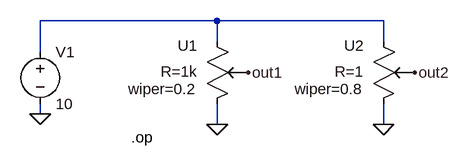
[diagram p0: schematic pot_test.asc]
pot_test.asc, the LTspice schematic file:
Version 4
SHEET 1 880 680
WIRE 272 48 0 48
WIRE 528 48 272 48
WIRE 272 80 272 48
WIRE 528 80 528 48
WIRE 0 96 0 48
WIRE 0 192 0 176
WIRE 272 208 272 176
WIRE 528 208 528 176
FLAG 272 208 0
FLAG 0 192 0
FLAG 320 128 out1
FLAG 528 208 0
FLAG 576 128 out2
SYMBOL voltage 0 80 R0
SYMATTR InstName V1
SYMATTR Value 10
SYMBOL pot 272 176 M0
SYMATTR InstName U1
SYMATTR SpiceLine2 wiper=0.2
SYMBOL pot 528 176 M0
SYMATTR InstName U2
SYMATTR SpiceLine R=1
SYMATTR SpiceLine2 wiper=0.8
TEXT 140 228 Left 2 !.op

The netlist it stands for:
* pot_test.asc
V1 N001 0 10
XU1 N001 0 out1 pot R=1k wiper=0.2  ; pins 1 2 3
XU2 N001 0 out2 pot R=1 wiper=0.8  ; pins 1 2 3
.op
.lib pot.lib
.backanno
.end